# Altium schematic sheet MCU.schdoc
size B; DocumentFullName: Microcontroller; Organization: Reclaimer Labs, LLC; Address1: 3652 Beth Ct; Address2: Santa Clara CA 95054; DocumentNumber: 2; SheetNumber: 2; SheetTotal: 3; License: Open Source Hardware - MIT License
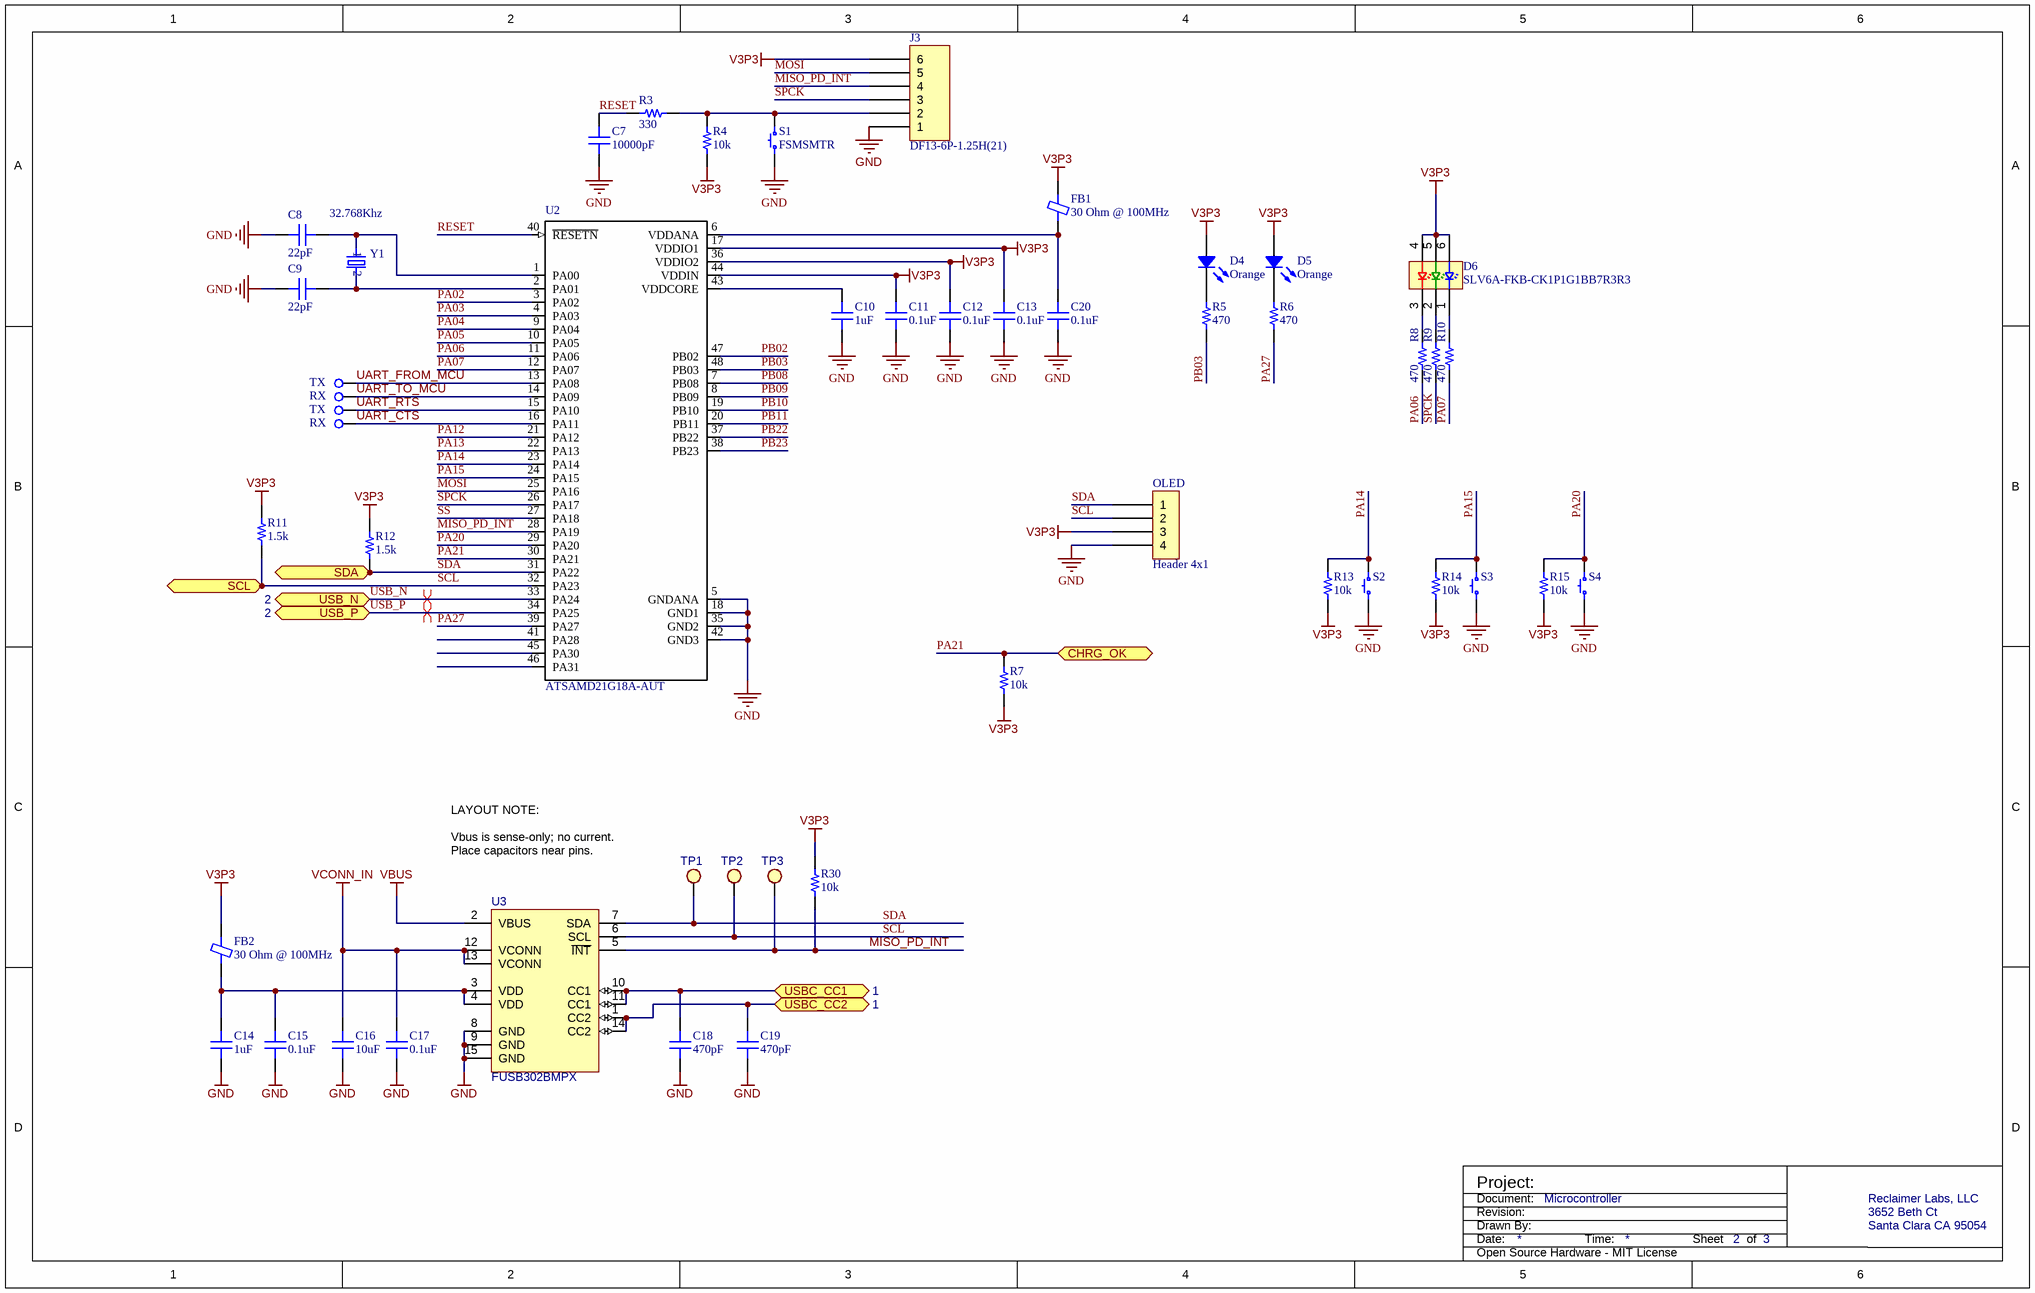
[diagram p0: MCU.schdoc]

## Parts
(Parts that share a designator on the sheet are numbered #1, #2 ... from top to bottom, then left to right.)
C7  10000pF  [CAP 0603/1608]
C8  22pF  [CAP 0603/1608]
C9  22pF  [CAP 0603/1608]
C10  1uF  [CAP 0603/1608]
C11  0.1uF  [CAP 0603/1608]
C12  0.1uF  [CAP 0603/1608]
C13  0.1uF  [CAP 0603/1608]
C14  1uF  [CAP 0603/1608]
C15  0.1uF  [CAP 0603/1608]
C16  10uF  [CAP 0805/2012]
C17  0.1uF  [CAP 0603/1608]
C18  470pF  [CAP 0603/1608]
C19  470pF  [CAP 0603/1608]
C20  0.1uF  [CAP 0603/1608]
D4  Orange  [LED 0805/2012 YELLOW]
D5  Orange  [LED 0805/2012 YELLOW]
D6  SLV6A-FKB-CK1P1G1BB7R3R3  [LED PLCC6-CREE 5.5x5.3MM]
FB1  30 Ohm @ 100MHz  [FER 0603/1608]
FB2  30 Ohm @ 100MHz  [FER 0603/1608]
J3  DF13-6P-1.25H(21)  [HIROSE DF13-6P-1.25H]
OLED  Header 4x1
R3  330  [RES 0402/1005]
R4  10k  [RES 0402/1005]
R5  470  [RES 0603/1608]
R6  470  [RES 0603/1608]
R7  10k  [RES 0402/1005]
R8  470  [RES 0603/1608]
R9  470  [RES 0603/1608]
R10  470  [RES 0603/1608]
R11  1.5k  [RES 0603/1608]
R12  1.5k  [RES 0603/1608]
R13  10k  [RES 0402/1005]
R14  10k  [RES 0402/1005]
R15  10k  [RES 0402/1005]
R30  10k  [RES 0402/1005]
RX#1  RCT-0C  [TE TP 0805]  (value not drawn)
RX#2  RCT-0C  [TE TP 0805]  (value not drawn)
S1  FSMSMTR  [TE FSMSMTR]
S2  FSMSMTR  [TE FSMSMTR]  (value not drawn)
S3  FSMSMTR  [TE FSMSMTR]  (value not drawn)
S4  FSMSMTR  [TE FSMSMTR]  (value not drawn)
TP1  TESTPOINT  [TP_1mm]  (value not drawn)  (no BOM)
TP2  TESTPOINT  [TP_1mm]  (value not drawn)  (no BOM)
TP3  TESTPOINT  [TP_1mm]  (value not drawn)  (no BOM)
TX#1  RCT-0C  [TE TP 0805]  (value not drawn)
TX#2  RCT-0C  [TE TP 0805]  (value not drawn)
U2  ATSAMD21G18A-AUT  [QFP50P900X900X120-48N]
U3  FUSB302BMPX  [MLP14]
Y1  32.768Khz  [RESONATOR_EPSON_FC_145]

## Ports
CHRG_OK (bidir, see 2), SCL (bidir, see 2), SDA (bidir, see 2), USB_N (bidir, see 2), USB_P (bidir, see 2), USBC_CC1 (bidir, see 1), USBC_CC2 (bidir, see 1)

## Nets
GND: C7.1 C8.2 C9.2 C10.1 C11.1 C12.1 C13.1 C14.1 C15.1 C16.1 C17.1 C18.1 C19.1 C20.1 J3.1 OLED.4 S1.1 S2.1 S3.1 S4.1 U2.5(GNDANA) U2.18(GND1) U2.35(GND2) U2.42(GND3) U3.8(GND) U3.9(GND) U3.15(GND)
V3P3: C11.2 C12.2 C13.2 D4.1 D5.1 D6.4(A3) D6.5(A2) D6.6(A1) FB1.1 FB2.1 J3.6 OLED.3 R4.1 R7.1 R11.2 R12.2 R13.1 R14.1 R15.1 R30.2 U2.17(VDDIO1) U2.36(VDDIO2) U2.44(VDDIN)
VBUS: U3.2(VBUS)
VCONN_IN: C16.2 C17.2 U3.12(VCONN) U3.13(VCONN)
MISO_PD_INT: J3.4 R30.1 TP3.1 U2.28(PA19) U3.5(~{INT})
MOSI: J3.5 U2.25(PA16)
PA02: U2.3(PA02)
PA03: U2.4(PA03)
PA04: U2.9(PA04)
PA05: U2.10(PA05)
PA06: R8.2 U2.11(PA06)
PA07: R10.2 U2.12(PA07)
PA12: U2.21(PA12)
PA13: U2.22(PA13)
PA14: R13.2 S2.2 U2.23(PA14)
PA15: R14.2 S3.2 U2.24(PA15)
PA20: R15.2 S4.2 U2.29(PA20)
PA21: R7.2 U2.30(PA21) ; port CHRG_OK
PA27: R6.2 U2.39(PA27)
PB02: U2.47(PB02)
PB03: R5.2 U2.48(PB03)
PB08: U2.7(PB08)
PB09: U2.8(PB09)
PB10: U2.19(PB10)
PB11: U2.20(PB11)
PB22: U2.37(PB22)
PB23: U2.38(PB23)
RESET: C7.2 R3.1 U2.40(~{RESETN})
SCL: OLED.2 R11.1 TP2.1 U2.32(PA23) U3.6(SCL) ; port SCL
SDA: OLED.1 R12.1 TP1.1 U2.31(PA22) U3.7(SDA) ; port SDA
SPCK: J3.3 R9.2 U2.26(PA17)
SS: U2.27(PA18)
UART_CTS: RX#2.1(TP) U2.16(PA11)
UART_FROM_MCU: TX#1.1(TP) U2.13(PA08)
UART_RTS: TX#2.1(TP) U2.15(PA10)
UART_TO_MCU: RX#1.1(TP) U2.14(PA09)
USB_N: U2.33(PA24) ; port USB_N
USB_P: U2.34(PA25) ; port USB_P
USBC_CC1: C18.2 U3.10(CC1) U3.11(CC1) ; port USBC_CC1
USBC_CC2: C19.2 U3.1(CC2) U3.14(CC2) ; port USBC_CC2
NetC8_1: C8.1 U2.1(PA00) Y1.P$1
NetC9_1: C9.1 U2.2(PA01) Y1.P$2
NetC10_2: C10.2 U2.43(VDDCORE)
NetC14_2: C14.2 C15.2 FB2.2 U3.3(VDD) U3.4(VDD)
NetC20_2: C20.2 FB1.2 U2.6(VDDANA)
NetD4_2: D4.2 R5.1
NetD5_2: D5.2 R6.1
NetD6_1: D6.1(C1) R10.1
NetD6_2: D6.2(C2) R9.1
NetD6_3: D6.3(C3) R8.1
NetJ3_2: J3.2 R3.2 R4.2 S1.2

Not connected (* = marked no-connect by the designer): U2 41(PA28) 45(PA30) 46(PA31)

## Layout directives
differential pair: USB_N, USB_P

## Notes on the sheet
- LAYOUT NOTE:
  Vbus is sense-only; no current.
  Place capacitors near pins.
- Project:
- Date:
- Revision:
- Drawn By:
- Document:
- Time:
- Sheet
- of

## Library data of the parts
C7 = C0603C103M5RACTU: CAP CER 10000PF 50V X7R 0603; Manufacturer: Kemet; TemperatureRange: -55C ~ 125C; Tolerance: 20%; Value: 10000pF; Part Number: C0603C103M5RACTU; PartId: 13383; Supplier 1: Digi-Key; Supplier Part Number 1: 399-7842-2-ND; ComponentLink1Description: Datasheet; ComponentLink1URL: http://www.kemet.com/docfinder?Partnumber=C0603C103M5RACTU; ComponentLink2Description: Digi-Key Listing; ComponentLink2URL: https://www.digikey.com/product-detail/en/kemet/C0603C103M5RACTU/399-7842-2-ND/2199766; TemperatureCoefficient: X7R; Voltage: 50V; Price: 0,0046; Device Package: 0603 (1608 Metric)
C8 C9 = C1608C0G1H220J080AA: CAP CER 22PF 50V C0G 0603; Manufacturer: TDK Corporation; TemperatureRange: -55C ~ 125C; TemperatureCoefficient: C0G, NP0; Tolerance: 5%; Value: 22pF; Part Number: C1608C0G1H220J080AA; PartId: 4031; Supplier 1: Digi-Key; Supplier Part Number 1: 445-1273-1-ND; ComponentLink1Description: Datasheet; ComponentLink1URL: https://product.tdk.com/info/en/catalog/datasheets/mlcc_commercial_general_en.pdf; ComponentLink2Description: Digi-Key listing; ComponentLink2URL: http://digikey.com/product-detail/en/C1608C0G1H220J080AA/445-1273-1-ND/567670; Voltage: 50V; Price: 0,14; Type: -; Device Package: 0603 (1608 Metric)
C10 C14 = C1608X7R1A105K080AC: CAP CER 1UF 10V X7R 0603; Manufacturer: TDK Corporation; TemperatureRange: -55C ~ 125C; Tolerance: 10%; Value: 1uF; Part Number: C1608X7R1A105K080AC; PartId: 4035; Supplier 1: Digi-Key; Supplier Part Number 1: 445-5138-1-ND; ComponentLink1Description: Datasheet; ComponentLink1URL: https://product.tdk.com/info/en/catalog/datasheets/mlcc_commercial_general_en.pdf; ComponentLink2Description: Digi-Key listing; ComponentLink2URL: http://digikey.com/product-detail/en/C1608X7R1A105K080AC/445-5138-1-ND/2093753; TemperatureCoefficient: X7R; Voltage: 10V; Price: 0,14; Type: -; Device Package: 0603 (1608 Metric)
C11-C13 C15 C17 C20 = C1608X7R1E104K080AA: CAP CER 0.1UF 25V X7R 0603; Manufacturer: TDK Corporation; TemperatureRange: -55C ~ 125C; Tolerance: 10%; Value: 0.1uF; Part Number: C1608X7R1E104K080AA; PartId: 4029; Supplier 1: Digi-Key; Supplier Part Number 1: 445-1316-1-ND; ComponentLink1Description: Datasheet; ComponentLink1URL: https://product.tdk.com/info/en/catalog/datasheets/mlcc_commercial_general_en.pdf; ComponentLink2Description: Digi-Key listing; ComponentLink2URL: http://digikey.com/product-detail/en/C1608X7R1E104K080AA/445-1316-1-ND/567697; TemperatureCoefficient: X7R; Voltage: 25V; Price: 0,14; Type: -; Device Package: 0603 (1608 Metric)
C16 = C2012X5R1V106M085AC: CAP CER 10UF 35V X5R 0805; Manufacturer: TDK Corporation; TemperatureRange: -55C ~ 85C; Tolerance: 20%; Value: 10uF; Part Number: C2012X5R1V106M085AC; PartId: 4768; Supplier 1: Digi-Key; Supplier Part Number 1: 445-14419-2-ND; ComponentLink1Description: Datasheet; ComponentLink1URL: https://product.tdk.com/info/en/catalog/datasheets/mlcc_commercial_general_en.pdf; ComponentLink2Description: Digi-Key listing; ComponentLink2URL: http://digikey.com/product-detail/en/C2012X5R1V106M085AC/445-14419-2-ND/3951655; TemperatureCoefficient: X5R; Voltage: 35V; Price: 0,2152; Type: -; Device Package: 0805 (2012 Metric)
C18 C19 = C0603C471J5GACTU: CAP CER 470PF 50V NP0 0603; Manufacturer: Kemet; TemperatureRange: -55C ~ 125C; TemperatureCoefficient: C0G, NP0; Tolerance: 5%; Value: 470pF; Part Number: C0603C471J5GACTU; PartId: 13172; Supplier 1: Digi-Key; Supplier Part Number 1: 399-7922-2-ND; ComponentLink1Description: Datasheet; ComponentLink1URL: http://www.kemet.com/docfinder?Partnumber=C0603C471J5GACTU; ComponentLink2Description: Digi-Key Listing; ComponentLink2URL: https://www.digikey.com/product-detail/en/kemet/C0603C471J5GACTU/399-7922-2-ND/2200803; Voltage: 50V; Price: 0,0087; Device Package: 0603 (1608 Metric)
D4 D5 = LTST-C170KFKT: LED ORANGE CLEAR 0805 SMD; Manufacturer: Lite-On Inc.; Value: Green; Type: Surface Mount; Millicandela: 90mcd; Voltage Forward: 2V; Current (Test): 20mA; Viewing Angle: 130; Part Number: LTST-C170KFKT; PartId: 7079; Supplier 1: Digi-Key; Supplier Part Number 1: 160-1413-2-ND; ComponentLink1Description: Datasheet; ComponentLink1URL: http://optoelectronics.liteon.com/upload/download/DS-22-99-0185/S_110_LTST-C170KFKT.pdf; ComponentLink2Description: Digi-Key Listing; ComponentLink2URL: http://www.digikey.ca/product-detail/en/LTST-C170KFKT/160-1413-2-ND/386775; Price: 0,0638; Device Package: 0805 (2012 Metric); Colour: Orange; Lens Transparency: Clear
D6 = SLV6A-FKB-CK1P1G1BB7R3R3: LED RGB 622NM 530NM 470NM 6SMD; Manufacturer: Cree Inc.; Colour: Red, Green, Blue (RGB); Millicandela: 840mcd Red, 1680mcd Green, 420mcd Blue; Voltage Forward: 2V Red, 3.2V Green, 3.2V Blue; Current (Test): 20mA Red, 20mA Green, 20mA Blue; Part Number: SLV6A-FKB-CK1P1G1BB7R3R3; PartId: 29699; Supplier 1: Digi-Key; Supplier Part Number 1: SLV6A-FKB-CK1P1G1BB7R3R3TR-ND; ComponentLink1Description: Datasheet; ComponentLink1URL: http://www.cree.com/led-components/media/documents/1320-SLV6A-FKB.pdf; ComponentLink2Description: Digi-Key Listing; ComponentLink2URL: https://www.digikey.com/product-detail/en/cree-inc/SLV6A-FKB-CK1P1G1BB7R3R3/SLV6A-FKB-CK1P1G1BB7R3R3TR-ND/5638271?; Price: 0,323; Device Package: 6-SMD, J-Lead; Lens Transparency: -; Viewing Angle: -
FB1 FB2 = MPZ1608S300ATAH0: FERRITE CHIP 30 OHM 5A 0603; Manufacturer: TDK Corporation; Type: Differential Mode - Single; DC Resistance: 10 mOhm Max; Part Number: MPZ1608S300ATAH0; PartId: 6638; Value: 30 Ohm @ 100MHz; Supplier 1: Digi-Key; Supplier Part Number 1: 445-1562-2-ND; ComponentLink1Description: Datasheet; ComponentLink1URL: https://product.tdk.com/info/en/catalog/datasheets/beads_commercial_power_mpz1608_en.pdf; ComponentLink2Description: Digi-Key listing; ComponentLink2URL: http://digikey.com/product-detail/en/MPZ1608S300ATAH0/445-1562-2-ND/571869; Price: 0,0298; Device Package: 0603 (1608 Metric); Current Rating: 5A
J3 = DF13-6P-1.25H(21): CONN HEADER 6POS 1.25MM RA TIN; Manufacturer: Hirose Electric Co Ltd; Pitch: 0.049" (1.25mm); Number Of Positions: 6; Part Number: DF13-6P-1.25H(21); Colour: Beige; PartId: 7800; Supplier 1: Digi-Key; Supplier Part Number 1: DF13-6P-1.25H(21)-ND; ComponentLink1Description: Datasheet; ComponentLink1URL: http://www.hirose.co.jp/cataloge_hp/en_DF13_20130411.pdf; ComponentLink2Description: Digi-Key Listing; ComponentLink2URL: http://www.digikey.ca/product-detail/en/DF13-6P-1.25H(21)/DF13-6P-1.25H(21)-ND/3977728; Price: 0,4969; Type: Surface Mount, Right Angle; Number Of Rows: 1; Series: DF13
R3 = ERJ-2GEJ331X: RES SMD 330 OHM 5% 1/10W 0402; Manufacturer: Panasonic Electronic Components; TemperatureRange: -55C ~ 155C; TemperatureCoefficient: 200ppm/C; PowerRating: 0.1W, 1/10W; Value: 330; Part Number: ERJ-2GEJ331X; PartId: 11000; Supplier 1: Digi-Key; Supplier Part Number 1: P330JTR-ND; ComponentLink1Description: Datasheet; ComponentLink1URL: http://industrial.panasonic.com/www-cgi/jvcr13pz.cgi?E+PZ+3+AOA0001+ERJ2GEJ331X+7+WW; ComponentLink2Description: Digi-Key Listing; ComponentLink2URL: https://www.digikey.com/product-detail/en/panasonic-electronic-components/ERJ-2GEJ331X/P330JTR-ND/146976; Tolerance: 5%; Price: 0,0019; Device Package: 0402 (1005 Metric)
R4 R7 R13-R15 R30 = ERJ-2GEJ103X: RES SMD 10K OHM 5% 1/10W 0402; Manufacturer: Panasonic Electronic Components; TemperatureRange: -55C ~ 155C; TemperatureCoefficient: 200ppm/C; PowerRating: 0.1W, 1/10W; Value: 10k; Part Number: ERJ-2GEJ103X; PartId: 10981; Supplier 1: Digi-Key; Supplier Part Number 1: P10KJTR-ND; ComponentLink1Description: Datasheet; ComponentLink1URL: http://industrial.panasonic.com/www-cgi/jvcr13pz.cgi?E+PZ+3+AOA0001+ERJ2GEJ103X+7+WW; ComponentLink2Description: Digi-Key Listing; ComponentLink2URL: https://www.digikey.com/product-detail/en/panasonic-electronic-components/ERJ-2GEJ103X/P10KJTR-ND/146735; Tolerance: 5%; Price: 0,0019; Device Package: 0402 (1005 Metric)
R5 R6 R8-R10 = ERJ-3GEYJ471V: RES SMD 470 OHM 5% 1/10W 0603; Manufacturer: Panasonic Electronic Components; TemperatureRange: -55C ~ 155C; TemperatureCoefficient: 200ppm/C; PowerRating: 0.1W, 1/10W; Value: 470; Part Number: ERJ-3GEYJ471V; PartId: 11180; Supplier 1: Digi-Key; Supplier Part Number 1: P470GTR-ND; ComponentLink1Description: Datasheet; ComponentLink1URL: http://industrial.panasonic.com/www-cgi/jvcr13pz.cgi?E+PZ+3+AOA0001+ERJ3GEYJ471V+7+WW; ComponentLink2Description: Digi-Key Listing; ComponentLink2URL: https://www.digikey.com/product-detail/en/panasonic-electronic-components/ERJ-3GEYJ471V/P470GTR-ND/135784; Tolerance: 5%; Price: 0,002; Device Package: 0603 (1608 Metric)
R11 R12 = ERJ-3GEYJ152V: RES SMD 1.5K OHM 5% 1/10W 0603; Manufacturer: Panasonic Electronic Components; TemperatureRange: -55C ~ 155C; TemperatureCoefficient: 200ppm/C; PowerRating: 0.1W, 1/10W; Value: 1.5k; Part Number: ERJ-3GEYJ152V; PartId: 11208; Supplier 1: Digi-Key; Supplier Part Number 1: P1.5KGTR-ND; ComponentLink1Description: Datasheet; ComponentLink1URL: http://industrial.panasonic.com/www-cgi/jvcr13pz.cgi?E+PZ+3+AOA0001+ERJ3GEYJ152V+7+WW; ComponentLink2Description: Digi-Key Listing; ComponentLink2URL: https://www.digikey.com/product-detail/en/panasonic-electronic-components/ERJ-3GEYJ152V/P1.5KGTR-ND/104381; Tolerance: 5%; Price: 0,002; Device Package: 0603 (1608 Metric)
RX#1 RX#2 TX#1 TX#2 = RCT-0C: 0805 PROBE PAD; Manufacturer: TE Connectivity AMP Connectors; Part Number: RCT-0C; PartId: 15704; Supplier 1: Digi-Key; Supplier Part Number 1: A106144CT-ND; ComponentLink1Description: Datasheet; ComponentLink1URL: http://www.te.com/commerce/DocumentDelivery/DDEController?Action=srchrtrv&DocNm=1773266&DocType=DS&DocLang=English; ComponentLink2Description: Digi-Key Listing; ComponentLink2URL: http://www.digikey.com/product-detail/en/te-connectivity-amp-connectors/RCT-0C/A106144CT-ND/3477801; Price: 0,14; Type: PC Test Point; Mounting Type: Surface Mount
S1-S4 = FSMSMTR: SWITCH TACTILE SPST-NO 0.05A 24V; Manufacturer: TE Connectivity Alcoswitch Switches; Switch Function: Off-Mom; Contact Rating @ Voltage: 0.05A @ 24VDC; Actuator Type: Standard; Actuator Orientation: Top Actuated; Illumination: Non-Illuminated; Operating Force: 180gf; Switch Travel: 0.25mm; Mechanical Life: 20,000 Cycles; Part Number: FSMSMTR; PartId: 8251; Supplier 1: Digi-Key; Supplier Part Number 1: 450-1758-2-ND; ComponentLink1Description: Datasheet; ComponentLink1URL: http://www.te.com/commerce/DocumentDelivery/DDEController?Action=srchrtrv&DocNm=1437566-3&DocType=Customer+Drawing&DocLang=English; ComponentLink2Description: Digi-Key Listing; ComponentLink2URL: http://www.digikey.com/product-detail/en/FSMSMTR/450-1758-2-ND/529671; Price: 0,175; Circuit: SPST-NO; Illumination Voltage: -; Illumination Type, Colour: -; Operating Temperature: -35C ~ 85C
U2 = ATSAMD21G18A-AUT: MCU 32-bit SAM D21 ARM Cortex M0+ RISC 256KB Flash 3.3V 48-Pin TQFP T/R; MF: Microchip; SnapEDA_Link: https://www.snapeda.com/parts/ATSAMD21G18A-AUT/Microchip/view-part/?ref=snap; Digi-Key_Part_Number: ATSAMD21G18A-AUTCT-ND; Digi-Key_Purchase_URL: https://www.digikey.co.uk/product-detail/en/microchip-technology/ATSAMD21G18A-AUT/ATSAMD21G18A-AUTCT-ND/4878879?utm_source=snapeda&utm_medium=aggregator&utm_campaign=symbol; MP: ATSAMD21G18A-AUT; Package: TQFP-48 Microchip; Value: *
U3 = FUSB302B: Manufacturer 1: Fairchild/ON; Value: FUSB302BMPX; Supplier 1: Digi-Key; Supplier Part Number 1: FUSB302BMPXCT-ND; Manufacturer Part Number 1: FUSB302BMPX
Y1 = RESONATOR_EPSON_FC_145